# EAGLE board untitled (EAGLE 7.7.0), part 1 of 2
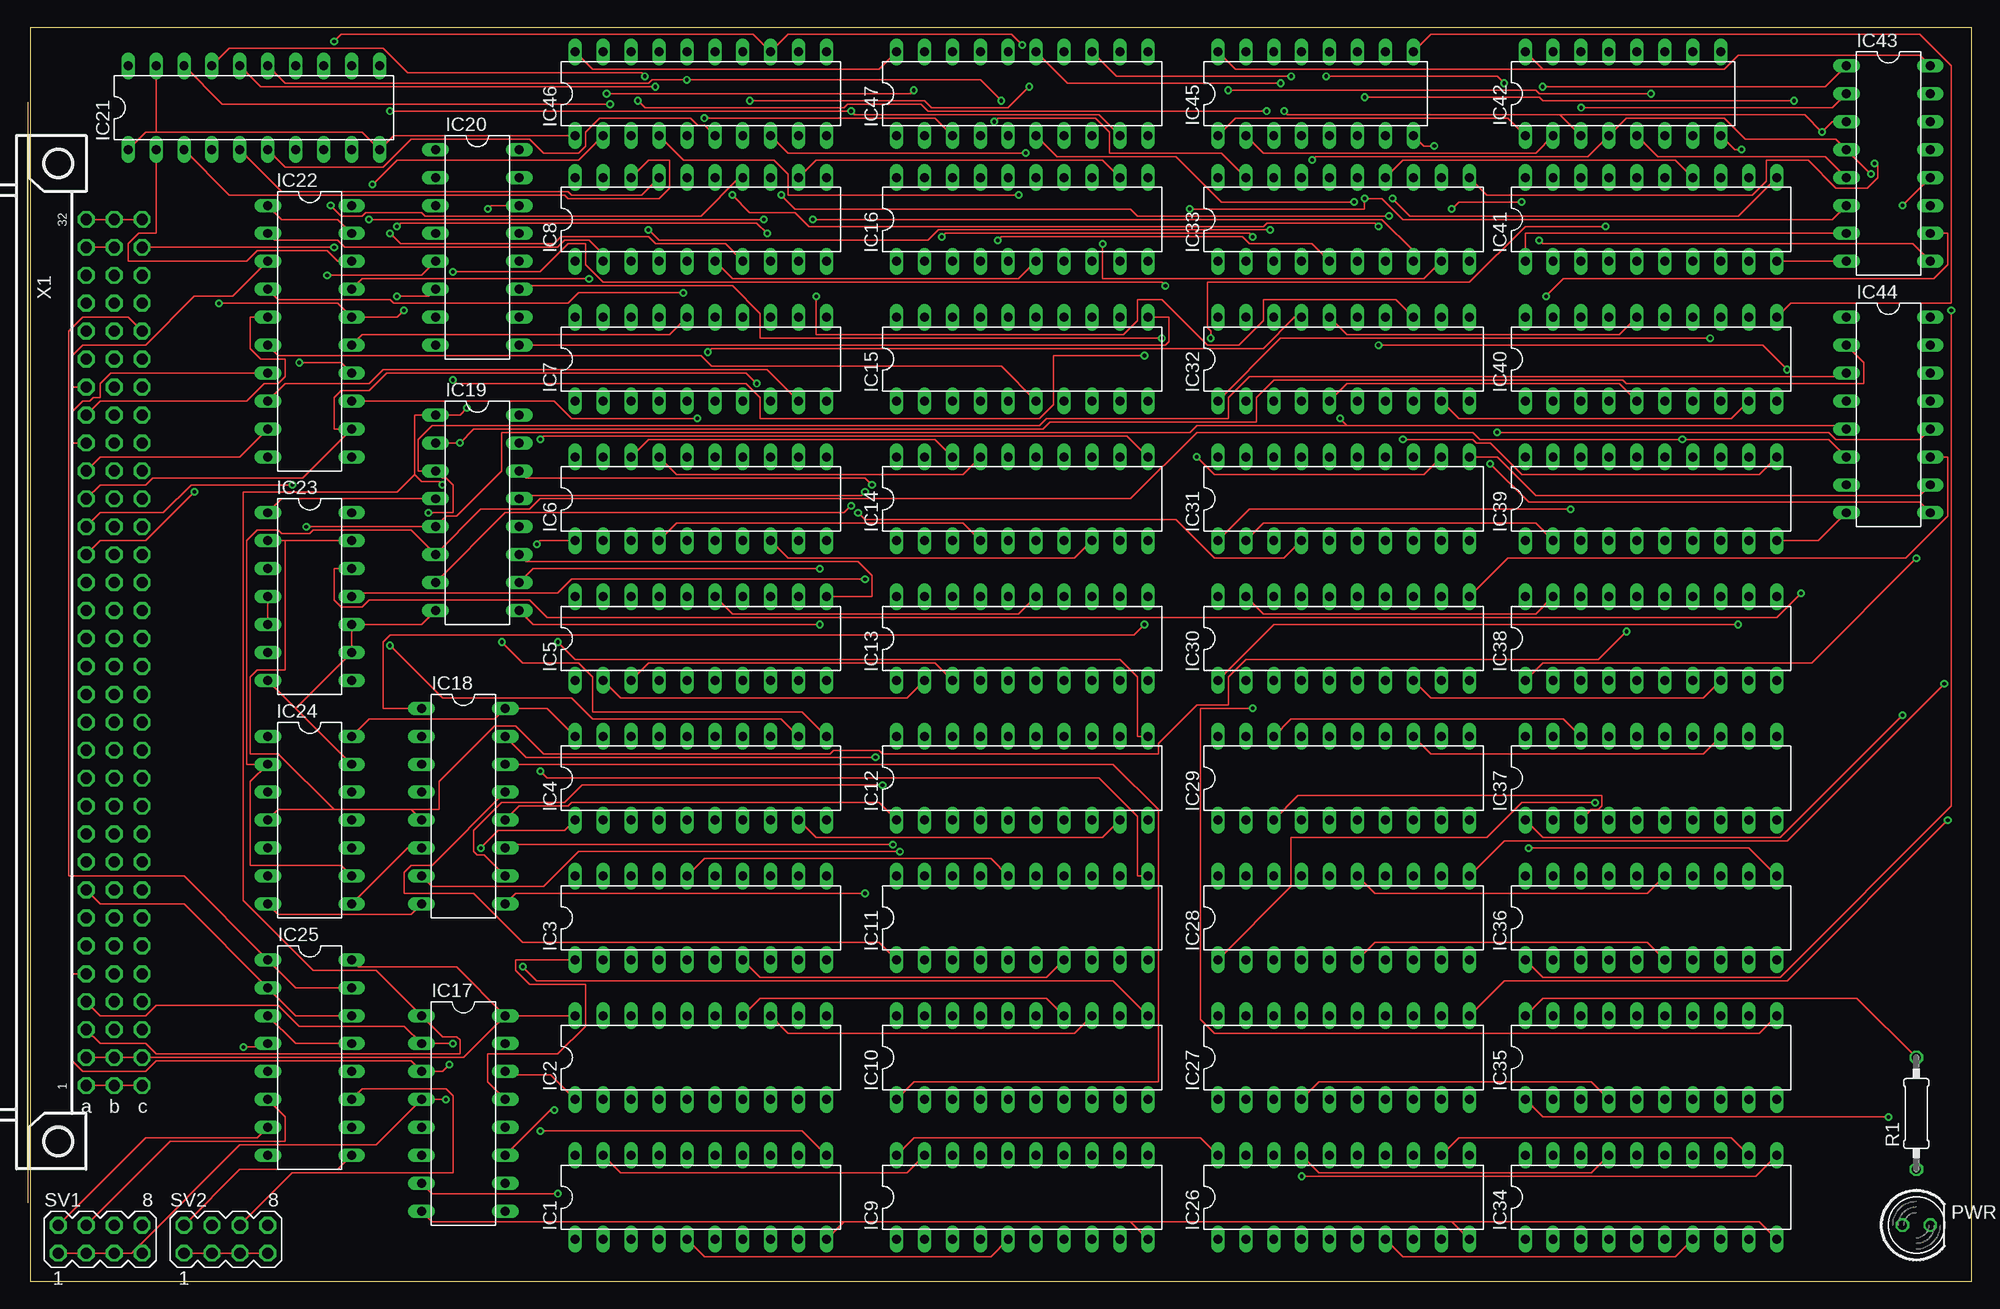
[diagram p4: board, top side]
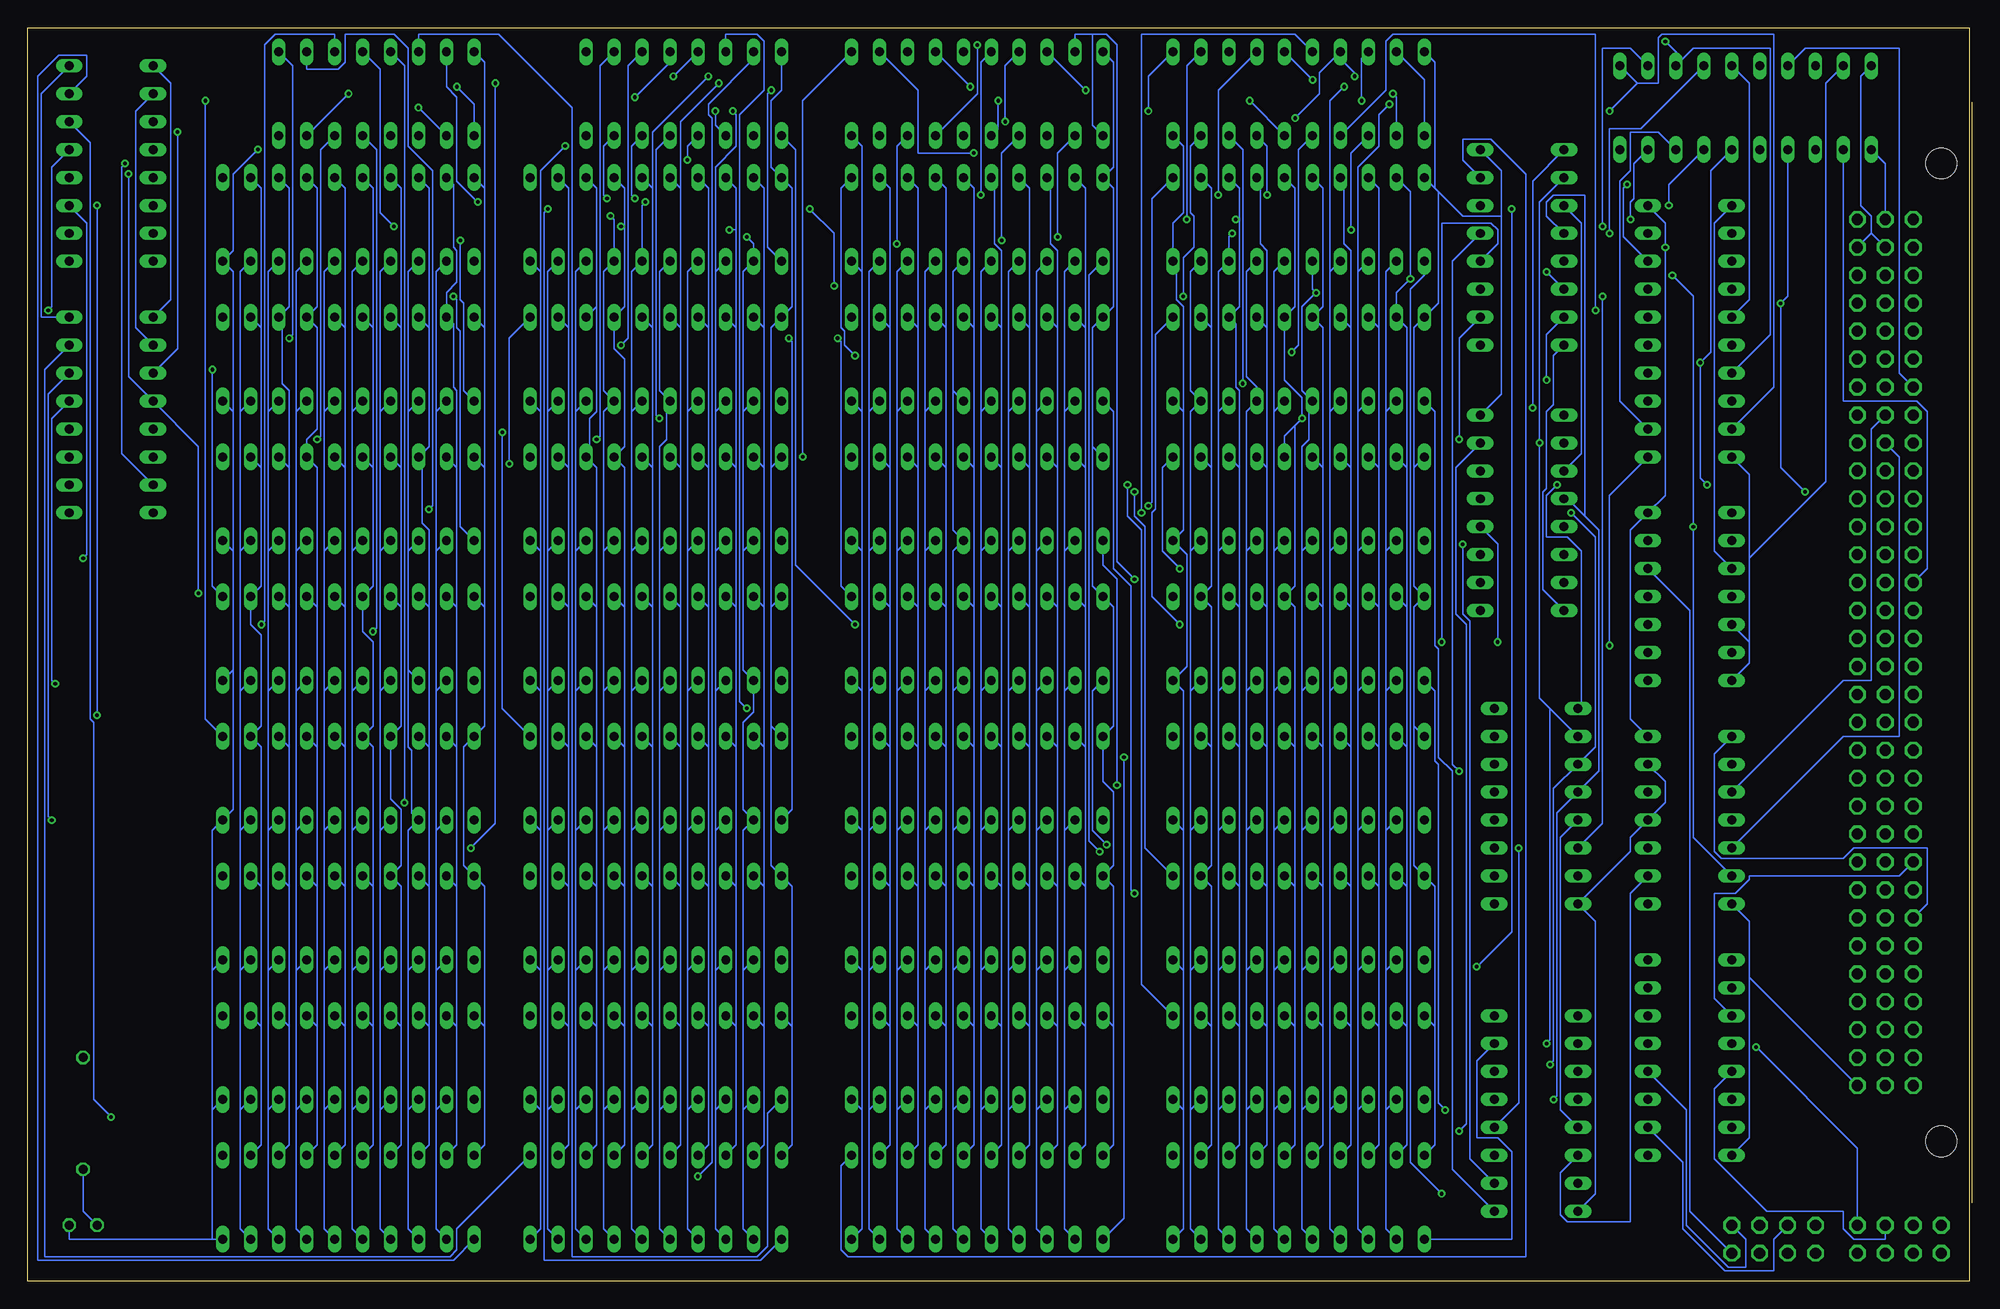
[diagram p5: board, bottom side, seen from below]

Size 176.51 x 113.97 mm. Coordinates in mm from the lower left corner, seen from the top.
Outline: 0,0 176.51,0 176.51,113.97 0,113.97 0,0
Copper layers (1*16): Top 0.0356mm / dielectric 1.5011mm / Bottom 0.0356mm
Design rules "LaenPCBOrder *": minimum track width 6mil, minimum drill 13mil, track to track 6mil, track to pad 6mil, pad to pad 6mil, via to via 6mil, smd to smd 6mil, copper to edge 15mil, drill to drill 6mil, minimum pad ring 7mil, minimum via ring 7mil, stop-mask expansion 3mil, vias tented up to drill 0mil, thermal gap 10mil

## Footprints (pad centres in the part's own frame; a part is rotated, then mirrored left to right if it is on the bottom)
DIL20 = drill 0.813 long: 1 -11.43,-3.81; 2 -8.89,-3.81; 3 -6.35,-3.81; 4 -3.81,-3.81; 5 -1.27,-3.81; 6 1.27,-3.81; 7 3.81,-3.81; 8 6.35,-3.81; 9 8.89,-3.81; 10 11.43,-3.81; 11 11.43,3.81; 12 8.89,3.81; 13 6.35,3.81; 14 3.81,3.81; 15 1.27,3.81; 16 -1.27,3.81; 17 -3.81,3.81; 18 -6.35,3.81; 19 -8.89,3.81; 20 -11.43,3.81
DIL16 = drill 0.813 long: 1 -8.89,-3.81; 2 -6.35,-3.81; 3 -3.81,-3.81; 4 -1.27,-3.81; 5 1.27,-3.81; 6 3.81,-3.81; 7 6.35,-3.81; 8 8.89,-3.81; 9 8.89,3.81; 10 6.35,3.81; 11 3.81,3.81; 12 1.27,3.81; 13 -1.27,3.81; 14 -3.81,3.81; 15 -6.35,3.81; 16 -8.89,3.81
DIL14 = drill 0.813 long: 1 -7.62,-3.81; 2 -5.08,-3.81; 3 -2.54,-3.81; 4 0,-3.81; 5 2.54,-3.81; 6 5.08,-3.81; 7 7.62,-3.81; 8 7.62,3.81; 9 5.08,3.81; 10 2.54,3.81; 11 0,3.81; 12 -2.54,3.81; 13 -5.08,3.81; 14 -7.62,3.81
LED5MM = drill 0.813 octagon: A -1.27,0; K 1.27,0
0207/10 = drill 0.813 octagon: 1 -5.08,0; 2 5.08,0
MA04-2 = drill 1.016 octagon: 1 -3.81,-1.27; 2 -3.81,1.27; 3 -1.27,-1.27; 4 -1.27,1.27; 5 1.27,-1.27; 6 1.27,1.27; 7 3.81,-1.27; 8 3.81,1.27
FABC96R = drill 1.016 octagon: A1 -2.54,39.37; A2 -2.54,36.83; A3 -2.54,34.29; A4 -2.54,31.75; A5 -2.54,29.21; A6 -2.54,26.67; A7 -2.54,24.13; A8 -2.54,21.59; A9 -2.54,19.05; A10 -2.54,16.51; A11 -2.54,13.97; A12 -2.54,11.43; A13 -2.54,8.89; A14 -2.54,6.35; A15 -2.54,3.81; A16 -2.54,1.27; A17 -2.54,-1.27; A18 -2.54,-3.81; A19 -2.54,-6.35; A20 -2.54,-8.89; A21 -2.54,-11.43; A22 -2.54,-13.97; A23 -2.54,-16.51; A24 -2.54,-19.05; A25 -2.54,-21.59; A26 -2.54,-24.13; A27 -2.54,-26.67; A28 -2.54,-29.21; A29 -2.54,-31.75; A30 -2.54,-34.29; A31 -2.54,-36.83; A32 -2.54,-39.37; B1 -5.08,39.37; B2 -5.08,36.83; B3 -5.08,34.29; B4 -5.08,31.75; B5 -5.08,29.21; B6 -5.08,26.67; B7 -5.08,24.13; B8 -5.08,21.59; B9 -5.08,19.05; B10 -5.08,16.51; B11 -5.08,13.97; B12 -5.08,11.43; B13 -5.08,8.89; B14 -5.08,6.35; B15 -5.08,3.81; B16 -5.08,1.27; B17 -5.08,-1.27; B18 -5.08,-3.81; B19 -5.08,-6.35; B20 -5.08,-8.89; B21 -5.08,-11.43; B22 -5.08,-13.97; B23 -5.08,-16.51; B24 -5.08,-19.05; B25 -5.08,-21.59; B26 -5.08,-24.13; B27 -5.08,-26.67; B28 -5.08,-29.21; B29 -5.08,-31.75; B30 -5.08,-34.29; B31 -5.08,-36.83; B32 -5.08,-39.37; C1 -7.62,39.37; C2 -7.62,36.83; C3 -7.62,34.29; C4 -7.62,31.75; C5 -7.62,29.21; C6 -7.62,26.67; C7 -7.62,24.13; C8 -7.62,21.59; C9 -7.62,19.05; C10 -7.62,16.51; C11 -7.62,13.97; C12 -7.62,11.43; C13 -7.62,8.89; C14 -7.62,6.35; C15 -7.62,3.81; C16 -7.62,1.27; C17 -7.62,-1.27; C18 -7.62,-3.81; C19 -7.62,-6.35; C20 -7.62,-8.89; C21 -7.62,-11.43; C22 -7.62,-13.97; C23 -7.62,-16.51; C24 -7.62,-19.05; C25 -7.62,-21.59; C26 -7.62,-24.13; C27 -7.62,-26.67; C28 -7.62,-29.21; C29 -7.62,-31.75; C30 -7.62,-34.29; C31 -7.62,-36.83; C32 -7.62,-39.37 | hole 2.794: 0,-44.456; 0,44.456

## Placement (x,y rotation side)
IC1  74LS374N  [DIL20]  60.96,7.62 0 top
IC2  74LS374N  [DIL20]  60.96,20.32 0 top
IC3  74LS374N  [DIL20]  60.96,33.02 0 top
IC4  74LS374N  [DIL20]  60.96,45.72 0 top
IC5  74LS374N  [DIL20]  60.96,58.42 0 top
IC6  74LS374N  [DIL20]  60.96,71.12 0 top
IC7  74LS374N  [DIL20]  60.96,83.82 0 top
IC8  74LS374N  [DIL20]  60.96,96.52 0 top
IC9  74LS374N  [DIL20]  90.17,7.62 0 top
IC10  74LS374N  [DIL20]  90.17,20.32 0 top
IC11  74LS374N  [DIL20]  90.17,33.02 0 top
IC12  74LS374N  [DIL20]  90.17,45.72 0 top
IC13  74LS374N  [DIL20]  90.17,58.42 0 top
IC14  74LS374N  [DIL20]  90.17,71.12 0 top
IC15  74LS374N  [DIL20]  90.17,83.82 0 top
IC16  74LS374N  [DIL20]  90.17,96.52 0 top
IC17  74LS138N  [DIL16]  39.37,15.24 270 top
IC18  74LS138N  [DIL16]  39.37,43.18 270 top
IC19  74LS138N  [DIL16]  40.64,69.85 270 top
IC20  74LS138N  [DIL16]  40.64,93.98 270 top
IC21  74LS244N  [DIL20]  20.32,106.68 0 top
IC22  74LS244N  [DIL20]  25.4,86.36 270 top
IC23  74LS32N  [DIL14]  25.4,62.23 270 top
IC24  74LS04N  [DIL14]  25.4,41.91 270 top
IC25  74LS139N  [DIL16]  25.4,20.32 270 top
IC26  74LS374N  [DIL20]  119.38,7.62 0 top
IC27  74LS374N  [DIL20]  119.38,20.32 0 top
IC28  74LS374N  [DIL20]  119.38,33.02 0 top
IC29  74LS374N  [DIL20]  119.38,45.72 0 top
IC30  74LS374N  [DIL20]  119.38,58.42 0 top
IC31  74LS374N  [DIL20]  119.38,71.12 0 top
IC32  74LS374N  [DIL20]  119.38,83.82 0 top
IC33  74LS374N  [DIL20]  119.38,96.52 0 top
IC34  74LS374N  [DIL20]  147.32,7.62 0 top
IC35  74LS374N  [DIL20]  147.32,20.32 0 top
IC36  74LS374N  [DIL20]  147.32,33.02 0 top
IC37  74LS374N  [DIL20]  147.32,45.72 0 top
IC38  74LS374N  [DIL20]  147.32,58.42 0 top
IC39  74LS374N  [DIL20]  147.32,71.12 0 top
IC40  74LS374N  [DIL20]  147.32,83.82 0 top
IC41  74LS374N  [DIL20]  147.32,96.52 0 top
IC42  74LS138N  [DIL16]  144.78,107.95 0 top
IC43  74LS138N  [DIL16]  168.91,101.6 270 top
IC44  74LS138N  [DIL16]  168.91,78.74 270 top
IC45  74LS138N  [DIL16]  116.84,107.95 0 top
IC46  74LS244N  [DIL20]  60.96,107.95 0 top
IC47  74LS244N  [DIL20]  90.17,107.95 0 top
PWR  l1  [LED5MM]  171.45,5.08 0 top
R1  330  [0207/10]  171.45,15.24 90 top
SV1  [MA04-2]  6.35,3.81 0 top
SV2  [MA04-2]  17.78,3.81 0 top
X1  FABC96R  [FABC96R]  2.54,57.15 180 top

## Tracks (layer width: path | path; a pad name or v marks a point on that pad's centre or on a via)
-BADDR4  (via drill 0.33)
  Top 0.152: IC44.6 163.51,76.52 v150.18,76.52 131.76,76.52 131.13,77.15 106.05,77.15 100.01,71.12 46.35,71.12 45.4,70.17 40.96,70.17 IC19.6 34.61,68.26 25.72,68.26 25.4,67.94 22.86,67.94 22.54,68.26 20.64,68.26 19.68,67.31 19.68,46.99 IC24.2 20,45.4 20,37.78 28.26,37.78 IC24.9
  Bottom 0.152: v150.18,76.52 149.86,76.83 149.86,102.87 IC42.6 | IC17.6 37.15,9.84 37.15,6.03 36.51,5.4 30.8,5.4 30.8,35.24 IC24.9
-BANK0-SEL  (via drill 0.33)
  Top 0.152: SV1.1 SV1.3 SV1.5 9.21,2.54 9.53,2.86 | 9.53,2.86 19.05,12.38 31.43,12.38 IC17.4 v37.78,16.51 | SV1.7 9.84,2.86 9.53,2.86 | IC23.1 22.86,71.12 IC19.4
  Bottom 0.152: 34.92,69.53 36.51,71.12 IC19.4 | 34.92,69.53 33.66,68.26 33.66,46.35 IC18.4 37.47,42.55 37.47,16.83 v37.78,16.51 | IC20.4 38.42,96.84 38.42,98.11 37.78,98.74 34.92,98.74 34.92,69.53
-BANK1-SEL  (via drill 0.33)
  Top 0.152: v167.32,100.65 IC43.4 164.15,103.82 155.89,103.82 153.99,105.73 145.1,105.73 IC42.4 141.6,102.23 116.84,102.23 v116.52,101.92 | SV2.1 SV2.3 SV2.5 SV2.7 | v160.97,62.55 158.75,60.33 46.99,60.33 45.4,61.91 30.8,61.91 30.16,61.28 28.26,61.28 27.62,61.91 27.62,64.77 IC23.12
  Bottom 0.152: v167.32,100.65 167.32,82.23 IC44.4 160.97,75.88 v160.97,62.55 | IC45.4 116.52,103.19 v116.52,101.92 | IC23.12 25.4,60.96 25.4,6.35 SV2.7
-BUS-ACTIVE
  Top 0.152: IC25.15 24.13,26.67 IC25.1 13.97,36.83 3.49,36.83 3.49,86.36 4.76,87.63 8.89,87.63 X1.C28
-MEMRD  (via drill 0.33)
  Top 0.152: IC43.5 163.19,102.23 147.96,102.23 IC42.5 | IC23.13 23.18,67.31 | 23.18,67.31 IC23.2 | IC24.4 22.54,42.86 27.62,42.86 | 34.61,42.86 27.62,42.86 | IC18.5 34.61,42.86 | 23.18,67.31 23.18,55.56 20.64,55.56 20,54.93 20,47.94 22.54,47.94 27.62,42.86 | v145.1,59.05 142.56,56.52 110.49,56.52 108.9,54.93 108.9,52.39 106.05,52.39 102.55,48.9 102.55,47.94 77.47,47.94 77.15,48.26 73.03,48.26 72.71,47.94 46.67,47.94 44.13,50.48 42.23,50.48 37.15,45.4 37.15,42.86 34.61,42.86
  Bottom 0.152: IC17.5 37.15,15.56 37.15,40.32 IC18.5 | IC42.5 144.78,102.87 144.78,59.37 v145.1,59.05
-MEMWR  (via drill 0.33)
  Top 0.152: v25.08,68.58 IC19.5 37.78,69.53 38.73,69.53 42.86,73.66 42.86,77.15 105.41,77.15 106.05,77.79 119.7,77.79 | IC20.5 35.56,91.44 v26.99,91.44 | 119.7,77.79 v119.06,78.42 | 119.7,77.79 164.78,77.79 IC44.5
  Bottom 0.152: IC24.6 25.08,40.32 v25.08,68.58 25.08,89.53 v26.99,91.44 | IC45.5 119.38,102.87 119.38,78.74 v119.06,78.42
ADDR0  (via drill 0.33)
  Top 0.152: IC45.1 109.54,105.73 134.3,105.73 IC42.1 | IC43.1 163.19,108.58 v137.48,108.58 | X1.A3 6.35,21.59 10.48,21.59 11.43,20.64 39.05,20.64 39.05,21.91 38.73,22.23 37.47,22.23 IC17.1 31.43,28.26 25.72,28.26 19.37,34.61 19.37,71.75 33.34,71.75 34.92,73.34 | v37.47,72.39 37.15,72.71 35.56,72.71 34.92,73.34 | 34.92,73.34 34.92,78.74 IC19.1 39.05,78.74 v39.69,79.38 | v101.28,59.69 100.33,58.74 32.7,58.74 32.07,58.1 32.07,52.07 IC18.1
  Bottom 0.152: IC44.1 163.51,89.22 163.51,108.9 IC43.1 | v137.48,108.58 135.89,107 IC42.1 | IC18.1 35.24,52.39 35.24,66.36 36.51,67.63 38.42,67.63 38.42,71.44 v37.47,72.39 | IC20.1 39.69,100.01 v39.69,79.38 | IC45.1 106.68,102.87 106.68,65.09 v101.28,59.69
ADDR1  (via drill 0.33)
  Top 0.152: IC45.2 112.08,102.55 136.84,102.55 IC42.2 | IC43.2 163.83,106.68 v140.97,106.68 | X1.A4 6.35,24.13 10.48,24.13 11.43,25.08 22.54,25.08 24.45,23.18 33.97,23.18 IC17.2 v38.42,21.59 | IC19.2 v39.05,76.2 40.32,77.47 92.08,77.47 92.71,78.11 111.44,78.11 111.44,80.33 113.03,81.92 144.78,81.92 145.1,81.6 166.69,81.6 166.69,83.5 IC44.2
  Bottom 0.152: IC44.2 166.69,86.68 166.69,106.36 IC43.2 | IC42.2 v140.97,106.68 | 38.1,52.07 39.05,53.02 v39.05,76.2 39.05,98.11 IC20.2 | 38.1,52.07 IC18.2 | v38.42,21.59 38.1,21.91 38.1,52.07
ADDR2  (via drill 0.33)
  Top 0.152: IC43.3 163.83,105.41 v162.88,104.46 161.29,106.05 139.06,106.05 | v113.98,106.36 114.3,106.05 139.06,106.05 | IC42.3 139.06,106.05 | X1.A5 3.81,27.94 3.81,20 4.76,19.05 10.48,19.05 11.43,20 34.61,20 IC17.3 37.47,19.05 v38.1,19.68 | v36.2,69.85 38.42,69.85 38.42,72.39 37.78,73.03 37.47,73.03 IC19.3 35.24,73.66 35.24,76.52 36.51,77.79 91.76,77.79 92.39,78.42 108.9,78.42 108.9,80.33 110.81,82.23 164.78,82.23 IC44.3
  Bottom 0.152: IC44.3 162.88,84.77 v162.88,104.46 | IC45.3 113.98,105.09 v113.98,106.36 | IC19.3 35.24,75.25 35.24,96.2 IC20.3 | v38.1,19.68 37.78,20 37.78,44.77 IC18.3 33.97,48.58 33.97,67.63 v36.2,69.85
ADDR4
  Bottom 0.152: IC24.1 23.18,47.94 23.18,39.05 22.54,38.42 11.43,38.42 10.48,39.37 3.81,39.37 3.81,34.29 X1.A7
ADDR5
  Top 0.152: IC25.14 24.13,24.13 IC25.2 13.97,34.29 6.35,34.29 X1.A8
ADDR6
  Top 0.152: IC25.3 24.13,21.59 IC25.13
  Bottom 0.152: X1.A9 6.35,36.83 20,36.83 20,36.51 21.27,35.24 23.18,35.24 23.18,25.72 IC25.3
BADDR4  (via drill 0.33)
  Top 0.152: IC43.6 163.83,96.52 124.78,96.52 122.87,98.42 v121.28,98.42 121.28,97.47 v105.41,97.47 | IC24.8 34.29,39.37 IC18.6 | IC20.6 36.2,89.53 v33.34,89.53 | v103.19,90.49 102.87,90.81 52.07,90.81 50.48,92.39 50.48,94.3 48.9,94.3 46.35,91.76 v38.42,91.76
  Bottom 0.152: v121.28,98.42 121.6,98.74 121.6,103.19 IC45.6 | v33.34,89.53 33.34,41.59 IC18.6 | v105.41,97.47 103.19,95.25 v103.19,90.49 | IC20.6 v38.42,91.76
DATA0  (via drill 0.33)
  Top 0.152: IC21.2 11.43,95.25 9.84,95.25 8.89,94.3 8.89,92.71 19.68,92.71 20.64,93.66 26.99,93.66 27.94,92.71 IC22.18 | IC46.2 49.85,101.92 33.34,101.92 v31.11,99.69 | v80.33,108.27 80.01,107.95 v52.39,107.95
  Bottom 0.152: v31.11,99.69 31.43,99.38 31.43,94.93 IC22.18 | v80.33,108.27 IC47.18 | v52.39,107.95 52.07,107.63 IC46.2 | X1.A19 3.81,64.77 3.81,79.06 4.76,80.01 11.43,80.01 IC21.2
DATA1  (via drill 0.33)
  Top 0.152: IC46.4 59.37,101.92 67.63,101.92 68.9,100.65 68.9,98.74 v89.85,98.74 | v17.14,88.9 27.94,88.9 IC22.16 33.34,87.63 v33.97,88.27 | X1.A20 6.35,67.31 10.48,67.31 v14.92,71.75
  Bottom 0.152: v89.85,98.74 89.85,110.81 IC47.16 | IC21.4 16.51,89.53 v17.14,88.9 17.14,73.98 v14.92,71.75 | IC46.4 53.02,108.27 53.02,112.71 52.39,113.35 33.97,113.35 v33.97,88.27
DATA2  (via drill 0.33)
  Top 0.152: IC22.14 28.26,83.5 v24.45,83.5 | IC46.6 61.28,105.09 60.64,105.09 60.01,105.73 51.75,105.73 50.48,104.46 50.48,103.19 49.85,102.55 46.67,102.55 45.4,103.82 34.61,103.82 32.07,101.28 23.18,101.28 IC21.6 | v90.81,108.58 88.9,106.68 81.92,106.68 81.28,107.31 v65.41,107.31 | X1.A21 6.35,69.85 12.06,69.85 14.61,72.39 v23.81,72.39
  Bottom 0.152: IC21.6 23.5,100.97 23.5,84.45 v24.45,83.5 24.45,73.03 v23.81,72.39 | v90.81,108.58 IC47.14 | IC46.6 v65.41,107.31
DATA3  (via drill 0.33)
  Top 0.152: IC46.8 68.9,102.55 v90.49,102.55 | X1.A22 6.35,72.39 10.48,72.39 11.11,73.03 24.77,73.03 IC22.12 27.62,77.47 27.62,80.33 28.26,80.96 30.8,80.96 32.38,82.55 65.09,82.55 v66.04,81.6
  Bottom 0.152: v90.49,102.55 95.57,102.55 95.57,108.27 IC47.12 | IC21.8 28.26,104.46 30.8,104.46 30.8,100.97 31.75,100.01 31.75,80.01 IC22.12 | IC46.8 66.04,102.87 v66.04,81.6
DATA4  (via drill 0.33)
  Top 0.152: IC47.9 97.16,106.05 74.93,106.05 v74.61,106.36 v32.7,106.36 | IC22.9 19.05,74.93 6.35,74.93 X1.A23
  Bottom 0.152: IC46.11 74.61,109.54 v74.61,106.36 | 30.16,108.9 IC21.11 | 30.16,108.9 28.26,108.9 28.26,113.03 27.94,113.35 17.78,113.35 17.78,81.28 IC22.9 | 30.16,108.9 v32.7,106.36
DATA5  (via drill 0.33)
  Top 0.152: v90.17,112.39 89.22,113.35 68.9,113.35 IC46.13 65.72,113.35 28.26,113.35 v27.62,112.71 | IC22.7 7.3,82.55 6.35,81.6 6.35,80.33 5.71,80.33 5.4,80.01 4.76,80.01 3.81,79.06 3.81,76.2 X1.A24
  Bottom 0.152: IC47.7 90.17,107.95 v90.17,112.39 | 26.04,111.12 25.08,112.08 18.1,112.08 18.1,86.04 IC22.7 | 26.04,111.12 IC21.13 | 26.04,111.12 v27.62,112.71
DATA6  (via drill 0.33)
  Top 0.152: IC21.15 23.18,108.9 56.2,108.9 56.52,109.22 v59.69,109.22 86.36,109.22 v88.27,107.31 | X1.A25 6.35,80.01 19.68,80.01 21.27,81.6 22.54,81.6 23.18,82.23 23.18,83.82 20.95,83.82 20,84.77 20,87.63 IC22.5
  Bottom 0.152: IC22.5 20,89.22 20,108.9 IC21.15 | v59.69,109.22 IC46.15 | IC47.5 88.27,104.78 v88.27,107.31
DATA7  (via drill 0.33)
  Top 0.152: v61.28,105.73 82.23,105.73 IC47.3 | IC22.3 18.41,89.53 14.92,89.53 10.48,85.09 4.76,85.09 3.81,84.14 3.81,81.28 X1.A26 | v55.88,109.54 55.56,109.86 34.29,109.86 32.07,112.08 18.1,112.08 IC21.17
  Bottom 0.152: 57.47,111.44 59.05,109.86 59.05,107.95 v61.28,105.73 | IC21.17 14.92,112.08 6.35,112.08 6.35,82.55 X1.A26 | 57.47,111.44 55.88,109.86 v55.88,109.54 | 57.47,111.44 IC46.17
DATA-IN0  (via drill 0.33)
  Top 0.152: IC21.18 17.46,107 v52.7,107 | IC13.3 82.23,56.2 56.2,56.2 IC5.3
  Bottom 0.152: IC9.3 84.77,4.76 84.77,15.56 | IC10.3 84.77,15.56 | 84.77,28.26 IC11.3 | 84.77,15.56 84.77,28.26 | 84.77,40.96 IC12.3 | 84.77,28.26 84.77,40.96 | 84.77,53.66 IC13.3 | 84.77,40.96 84.77,53.66 | 84.77,66.36 IC14.3 | 84.77,53.66 84.77,66.36 | 84.77,79.06 IC15.3 | 84.77,66.36 84.77,79.06 | IC16.3 84.77,91.76 84.77,79.06 | IC1.3 55.56,4.76 55.56,15.56 | IC2.3 55.56,15.56 | 55.56,28.26 IC3.3 | 55.56,15.56 55.56,28.26 | 55.56,40.96 IC4.3 | 55.56,28.26 55.56,40.96 | 55.56,53.66 IC5.3 | 55.56,40.96 55.56,53.66 | 55.56,66.36 IC6.3 | 55.56,53.66 55.56,66.36 | 55.56,79.06 IC7.3 | 55.56,66.36 55.56,79.06 | 55.56,91.76 IC8.3 | 55.56,79.06 55.56,91.76 | v52.7,107 53.66,106.05 53.66,103.19 55.56,101.28 55.56,91.76
DATA-IN1  (via drill 0.33)
  Top 0.152: IC21.16 20.95,108.58 v56.83,108.58 | IC14.4 84.77,68.9 58.74,68.9 IC6.4
  Bottom 0.152: IC9.4 87.31,4.76 87.31,15.56 | IC10.4 87.31,15.56 | 87.31,28.26 IC11.4 | 87.31,15.56 87.31,28.26 | 87.31,40.96 IC12.4 | 87.31,28.26 87.31,40.96 | 87.31,53.66 IC13.4 | 87.31,40.96 87.31,53.66 | 87.31,66.36 IC14.4 | 87.31,53.66 87.31,66.36 | 87.31,79.06 IC15.4 | 87.31,66.36 87.31,79.06 | IC16.4 87.31,91.76 87.31,79.06 | IC1.4 58.1,4.76 58.1,15.56 | IC2.4 58.1,15.56 | 58.1,28.26 IC3.4 | 58.1,15.56 58.1,28.26 | 58.1,40.96 IC4.4 | 58.1,28.26 58.1,40.96 | 58.1,53.66 IC5.4 | 58.1,40.96 58.1,53.66 | 58.1,66.36 IC6.4 | 58.1,53.66 58.1,66.36 | 58.1,79.06 IC7.4 | 58.1,66.36 58.1,79.06 | 58.1,91.76 IC8.4 | 58.1,79.06 58.1,91.76 | v56.83,108.58 58.1,107.31 58.1,91.76
DATA-IN2  (via drill 0.33)
  Top 0.152: v32.7,95.25 33.66,94.3 47.62,94.3 48.26,94.93 56.2,94.93 56.83,94.3 63.18,94.3 IC8.7 | IC11.7 92.39,27.62 66.36,27.62 IC3.7
  Bottom 0.152: IC9.7 94.93,4.76 94.93,15.56 | IC10.7 94.93,15.56 | 94.93,28.26 IC11.7 | 94.93,15.56 94.93,28.26 | 94.93,40.96 IC12.7 | 94.93,28.26 94.93,40.96 | 94.93,53.66 IC13.7 | 94.93,40.96 94.93,53.66 | 94.93,66.36 IC14.7 | 94.93,53.66 94.93,66.36 | 94.93,79.06 IC15.7 | 94.93,66.36 94.93,79.06 | IC16.7 94.93,91.76 94.93,79.06 | IC1.7 65.72,4.76 65.72,15.56 | IC2.7 65.72,15.56 | 65.72,28.26 IC3.7 | 65.72,15.56 65.72,28.26 | 65.72,40.96 IC4.7 | 65.72,28.26 65.72,40.96 | 65.72,53.66 IC5.7 | 65.72,40.96 65.72,53.66 | 65.72,66.36 IC6.7 | 65.72,53.66 65.72,66.36 | 65.72,66.36 65.72,79.06 IC7.7 64.77,81.28 65.72,82.23 65.72,91.76 IC8.7 | IC21.14 29.84,104.78 32.7,104.78 v32.7,95.25
DATA-IN3  (via drill 0.33)
  Top 0.152: v33.34,95.89 33.66,96.2 66.04,96.2 v66.99,95.25 | IC14.8 94.93,65.72 68.9,65.72 IC6.8
  Bottom 0.152: IC9.8 97.47,4.76 97.47,15.56 | IC10.8 97.47,15.56 | 97.47,28.26 IC11.8 | 97.47,15.56 97.47,28.26 | 97.47,40.96 IC12.8 | 97.47,28.26 97.47,40.96 | 97.47,53.66 IC13.8 | 97.47,40.96 97.47,53.66 | 97.47,66.36 IC14.8 | 97.47,53.66 97.47,66.36 | 97.47,79.06 IC15.8 | 97.47,66.36 97.47,79.06 | IC16.8 97.47,91.76 97.47,79.06 | IC1.8 68.26,4.76 68.26,15.56 | IC2.8 68.26,15.56 | 68.26,28.26 IC3.8 | 68.26,15.56 68.26,28.26 | 68.26,40.96 IC4.8 | 68.26,28.26 68.26,40.96 | 68.26,53.66 IC5.8 | 68.26,40.96 68.26,53.66 | 68.26,66.36 IC6.8 | 68.26,53.66 68.26,66.36 | 68.26,79.06 IC7.8 | 68.26,66.36 68.26,79.06 | 68.26,79.06 68.26,91.76 IC8.8 67.31,94.93 v66.99,95.25 | IC21.12 30.8,112.08 33.34,112.08 v33.34,95.89
DATA-IN4  (via drill 0.33)
  Top 0.152: v66.67,96.52 v30.8,96.52 | IC10.13 94.93,22.54 68.9,22.54 IC2.13
  Bottom 0.152: IC9.13 95.57,12.38 95.57,23.18 | IC10.13 95.57,23.18 | 95.57,35.88 IC11.13 | 95.57,23.18 95.57,35.88 | 95.57,48.58 IC12.13 | 95.57,35.88 95.57,48.58 | 95.57,61.28 IC13.13 | 95.57,48.58 95.57,61.28 | 95.57,73.98 IC14.13 | 95.57,61.28 95.57,73.98 | 95.57,86.68 IC15.13 | 95.57,73.98 95.57,86.68 | IC16.13 95.57,99.38 95.57,86.68 | 66.36,96.52 66.36,99.38 IC8.13 | 66.36,96.52 66.36,88.58 IC7.13 66.67,87 66.67,81.28 66.36,80.96 66.36,73.98 | IC21.9 30.48,101.6 30.48,98.42 30.8,98.11 v30.8,96.52 | 66.36,96.52 v66.67,96.52 | IC1.13 66.36,12.38 66.36,23.18 | IC2.13 66.36,23.18 | 66.36,35.88 IC3.13 | 66.36,23.18 66.36,35.88 | 66.36,48.58 IC4.13 | 66.36,35.88 66.36,48.58 | 66.36,61.28 IC5.13 | 66.36,48.58 66.36,61.28 | 66.36,73.98 IC6.13 | 66.36,61.28 66.36,73.98
DATA-IN5  (via drill 0.33)
  Top 0.152: v27.3,97.79 28.26,96.84 30.16,96.84 30.48,97.16 35.56,97.16 35.88,96.84 60.96,96.84 64.45,100.33 IC8.14 | IC10.14 92.39,25.72 66.36,25.72 IC2.14
  Bottom 0.152: IC9.14 93.03,12.38 93.03,23.18 | IC10.14 93.03,23.18 | 93.03,35.88 IC11.14 | 93.03,23.18 93.03,35.88 | 93.03,48.58 IC12.14 | 93.03,35.88 93.03,48.58 | 93.03,61.28 IC13.14 | 93.03,48.58 93.03,61.28 | 93.03,73.98 IC14.14 | 93.03,61.28 93.03,73.98 | 93.03,86.68 IC15.14 | 93.03,73.98 93.03,86.68 | IC16.14 93.03,99.38 93.03,86.68 | IC1.14 63.82,12.38 63.82,23.18 | IC2.14 63.82,23.18 | 63.82,35.88 IC3.14 | 63.82,23.18 63.82,35.88 | 63.82,48.58 IC4.14 | 63.82,35.88 63.82,48.58 | 63.82,61.28 IC5.14 | 63.82,48.58 63.82,61.28 | 63.82,73.98 IC6.14 | 63.82,61.28 63.82,73.98 | 63.82,86.68 IC7.14 | 63.82,73.98 63.82,86.68 | IC8.14 64.45,100.01 64.45,94.3 63.82,93.66 63.82,86.68 | IC21.7 27.3,99.69 v27.3,97.79
DATA-IN6
  Top 0.152: IC21.5 22.86,99.06 48.9,99.06 49.21,98.74 55.56,98.74 IC8.17 | IC14.17 84.77,73.34 58.74,73.34 IC6.17
  Bottom 0.152: IC9.17 85.41,12.38 85.41,23.18 | IC10.17 85.41,23.18 | 85.41,35.88 IC11.17 | 85.41,23.18 85.41,35.88 | 85.41,48.58 IC12.17 | 85.41,35.88 85.41,48.58 | 85.41,61.28 IC13.17 | 85.41,48.58 85.41,61.28 | 85.41,73.98 IC14.17 | 85.41,61.28 85.41,73.98 | 85.41,86.68 IC15.17 | 85.41,73.98 85.41,86.68 | IC16.17 85.41,99.38 85.41,86.68 | IC1.17 56.2,12.38 56.2,23.18 | IC2.17 56.2,23.18 | 56.2,35.88 IC3.17 | 56.2,23.18 56.2,35.88 | 56.2,48.58 IC4.17 | 56.2,35.88 56.2,48.58 | 56.2,61.28 IC5.17 | 56.2,48.58 56.2,61.28 | 56.2,73.98 IC6.17 | 56.2,61.28 56.2,73.98 | 56.2,86.68 IC7.17 | 56.2,73.98 56.2,86.68 | IC8.17 56.83,100.01 56.83,94.3 56.2,93.66 56.2,86.68
DATA-IN7
  Top 0.152: IC21.3 18.1,98.74 48.58,98.74 48.9,98.42 57.15,98.42 58.1,99.38 58.1,101.92 56.2,101.92 IC8.18 | IC14.18 82.23,76.52 56.2,76.52 IC6.18
  Bottom 0.152: IC9.18 82.87,12.38 82.87,23.18 | IC10.18 82.87,23.18 | 82.87,35.88 IC11.18 | 82.87,23.18 82.87,35.88 | 82.87,48.58 IC12.18 | 82.87,35.88 82.87,48.58 | 82.87,61.28 IC13.18 | 82.87,48.58 82.87,61.28 | 82.87,73.98 IC14.18 | 82.87,61.28 82.87,73.98 | 82.87,86.68 IC15.18 | 82.87,73.98 82.87,86.68 | IC16.18 83.5,100.01 83.5,94.3 82.87,93.66 82.87,86.68 | IC1.18 53.66,12.38 53.66,23.18 | IC2.18 53.66,23.18 | 53.66,35.88 IC3.18 | 53.66,23.18 53.66,35.88 | 53.66,48.58 IC4.18 | 53.66,35.88 53.66,48.58 | 53.66,61.28 IC5.18 | 53.66,48.58 53.66,61.28 | 53.66,73.98 IC6.18 | 53.66,61.28 53.66,73.98 | 53.66,86.68 IC7.18 | 53.66,73.98 53.66,86.68 | IC8.18 53.66,99.38 53.66,86.68
DATA-OUT0
  Top 0.152: IC22.2 22.23,94.61 27.94,94.61 28.57,93.98 47.94,93.98 48.58,94.61 50.8,94.61 52.07,93.34 IC8.2 | IC13.2 79.69,53.02 53.66,53.02 IC5.2
  Bottom 0.152: IC9.2 82.23,4.76 82.23,15.56 | IC10.2 82.23,15.56 | 82.23,28.26 IC11.2 | 82.23,15.56 82.23,28.26 | 82.23,40.96 IC12.2 | 82.23,28.26 82.23,40.96 | 82.23,53.66 IC13.2 | 82.23,40.96 82.23,53.66 | 82.23,66.36 IC14.2 | 82.23,53.66 82.23,66.36 | 82.23,79.06 IC15.2 | 82.23,66.36 82.23,79.06 | IC16.2 82.23,91.76 82.23,79.06 | IC1.2 53.02,4.76 53.02,15.56 | IC2.2 53.02,15.56 | 53.02,28.26 IC3.2 | 53.02,15.56 53.02,28.26 | 53.02,40.96 IC4.2 | 53.02,28.26 53.02,40.96 | 53.02,53.66 IC5.2 | 53.02,40.96 53.02,53.66 | 53.02,66.36 IC6.2 | 53.02,53.66 53.02,66.36 | 53.02,79.06 IC7.2 | 53.02,66.36 53.02,79.06 | IC8.2 53.02,91.76 53.02,79.06
DATA-OUT1  (via drill 0.33)
  Top 0.152: IC22.4 22.54,89.22 32.7,89.22 33.02,88.9 48.9,88.9 49.85,89.85 v59.37,89.85 | IC9.5 87.31,2.22 61.28,2.22 IC1.5
  Bottom 0.152: IC9.5 89.85,4.76 89.85,15.56 | IC10.5 89.85,15.56 | 89.85,28.26 IC11.5 | 89.85,15.56 89.85,28.26 | 89.85,40.96 IC12.5 | 89.85,28.26 89.85,40.96 | 89.85,53.66 IC13.5 | 89.85,40.96 89.85,53.66 | 89.85,66.36 IC14.5 | 89.85,53.66 89.85,66.36 | 89.85,79.06 IC15.5 | 89.85,66.36 89.85,79.06 | IC16.5 89.85,91.76 89.85,79.06 | IC8.5 59.69,90.17 v59.37,89.85 60.64,88.58 60.64,80.96 IC7.5 60.01,79.69 60.01,76.52 60.64,75.88 60.64,66.36 | IC1.5 60.64,4.76 60.64,15.56 | IC2.5 60.64,15.56 | 60.64,28.26 IC3.5 | 60.64,15.56 60.64,28.26 | 60.64,40.96 IC4.5 | 60.64,28.26 60.64,40.96 | 60.64,53.66 IC5.5 | 60.64,40.96 60.64,53.66 | 60.64,66.36 IC6.5 | 60.64,53.66 60.64,66.36
DATA-OUT2
  Top 0.152: IC22.6 22.54,84.14 60.96,84.14 61.91,83.19 88.27,83.19 IC15.6 | IC8.6 63.82,91.12 89.85,91.12 IC16.6
  Bottom 0.152: IC1.6 63.18,4.76 63.18,15.56 | IC2.6 63.18,15.56 | 63.18,28.26 IC3.6 | 63.18,15.56 63.18,28.26 | 63.18,40.96 IC4.6 | 63.18,28.26 63.18,40.96 | 63.18,53.66 IC5.6 | 63.18,40.96 63.18,53.66 | 63.18,66.36 IC6.6 | 63.18,53.66 63.18,66.36 | 63.18,79.06 IC7.6 | 63.18,66.36 63.18,79.06 | IC8.6 63.18,91.76 63.18,79.06 | IC9.6 92.39,4.76 92.39,15.56 | IC10.6 92.39,15.56 | 92.39,28.26 IC11.6 | 92.39,15.56 92.39,28.26 | 92.39,40.96 IC12.6 | 92.39,28.26 92.39,40.96 | 92.39,53.66 IC13.6 | 92.39,40.96 92.39,53.66 | 92.39,53.66 92.39,66.36 IC14.6 92.39,68.26 92.39,80.96 | IC16.6 92.39,91.76 92.39,80.96 | IC15.6 92.39,80.96
DATA-OUT3
  Top 0.152: IC22.8 23.18,81.6 30.8,81.6 32.07,82.87 66.99,82.87 IC7.9 | IC12.9 97.47,40.32 71.44,40.32 IC4.9
  Bottom 0.152: IC9.9 100.01,4.76 100.01,15.56 | IC10.9 100.01,15.56 | 100.01,28.26 IC11.9 | 100.01,15.56 100.01,28.26 | 100.01,40.96 IC12.9 | 100.01,28.26 100.01,40.96 | 100.01,53.66 IC13.9 | 100.01,40.96 100.01,53.66 | 100.01,66.36 IC14.9 | 100.01,53.66 100.01,66.36 | 100.01,79.06 IC15.9 | 100.01,66.36 100.01,79.06 | IC16.9 100.01,91.76 100.01,79.06 | IC8.9 70.8,91.76 70.8,80.96 IC7.9 70.8,79.06 70.8,66.36 | IC1.9 70.8,4.76 70.8,15.56 | IC2.9 70.8,15.56 | 70.8,28.26 IC3.9 | 70.8,15.56 70.8,28.26 | 70.8,40.96 IC4.9 | 70.8,28.26 70.8,40.96 | 70.8,53.66 IC5.9 | 70.8,40.96 70.8,53.66 | 70.8,66.36 IC6.9 | 70.8,53.66 70.8,66.36
DATA-OUT4  (via drill 0.33)
  Top 0.152: v32.7,57.78 37.47,53.02 49.21,53.02 51.12,51.12 68.26,51.12 IC4.12 | IC16.12 97.47,101.92 71.44,101.92 IC8.12
  Bottom 0.152: IC9.12 98.11,12.38 98.11,23.18 | IC10.12 98.11,23.18 | 98.11,35.88 IC11.12 | 98.11,23.18 98.11,35.88 | 98.11,48.58 IC12.12 | 98.11,35.88 98.11,48.58 | 98.11,61.28 IC13.12 | 98.11,48.58 98.11,61.28 | 98.11,73.98 IC14.12 | 98.11,61.28 98.11,73.98 | 98.11,86.68 IC15.12 | 98.11,73.98 98.11,86.68 | IC16.12 98.11,99.38 98.11,86.68 | 68.9,73.98 68.9,63.18 IC5.12 68.9,61.28 68.9,48.58 | IC6.12 68.9,73.98 | 68.9,86.68 IC7.12 | 68.9,73.98 68.9,86.68 | IC8.12 68.9,99.38 68.9,86.68 | IC1.12 68.9,12.38 68.9,23.18 | IC2.12 68.9,23.18 | 68.9,23.18 68.9,35.88 IC3.12 68.9,37.78 68.9,48.58 | IC22.11 32.7,71.44 v32.7,57.78 | IC4.12 68.9,48.58
DATA-OUT5  (via drill 0.33)
  Top 0.152: IC22.13 47.62,80.01 49.21,78.42 v60.64,78.42 | IC13.15 89.85,60.64 63.82,60.64 IC5.15
  Bottom 0.152: IC9.15 90.49,12.38 90.49,23.18 | IC10.15 90.49,23.18 | 90.49,35.88 IC11.15 | 90.49,23.18 90.49,35.88 | 90.49,48.58 IC12.15 | 90.49,35.88 90.49,48.58 | 90.49,61.28 IC13.15 | 90.49,48.58 90.49,61.28 | 90.49,73.98 IC14.15 | 90.49,61.28 90.49,73.98 | 90.49,86.68 IC15.15 | 90.49,73.98 90.49,86.68 | IC16.15 90.49,99.38 90.49,86.68 | IC1.15 61.28,12.38 61.28,23.18 | IC2.15 61.28,23.18 | 61.28,35.88 IC3.15 | 61.28,23.18 61.28,35.88 | 61.28,48.58 IC4.15 | 61.28,35.88 61.28,48.58 | 61.28,48.58 61.28,61.28 IC5.15 61.28,63.18 61.28,77.79 | 61.28,77.79 62.23,76.83 IC6.15 | 61.28,77.79 v60.64,78.42 60.64,80.33 62.23,81.92 IC7.15 61.28,88.58 61.28,99.38 IC8.15
DATA-OUT6
  Top 0.152: IC22.15 30.16,86.04 58.1,86.04 IC7.16 | IC11.16 87.31,38.42 61.28,38.42 IC3.16
  Bottom 0.152: IC9.16 87.95,12.38 87.95,23.18 | IC10.16 87.95,23.18 | 87.95,35.88 IC11.16 | 87.95,23.18 87.95,35.88 | 87.95,48.58 IC12.16 | 87.95,35.88 87.95,48.58 | 87.95,61.28 IC13.16 | 87.95,48.58 87.95,61.28 | 87.95,73.98 IC14.16 | 87.95,61.28 87.95,73.98 | 87.95,86.68 IC15.16 | 87.95,73.98 87.95,86.68 | IC16.16 88.58,100.01 88.58,94.3 87.95,93.66 87.95,86.68 | IC8.16 58.74,99.38 58.74,88.58 IC7.16 58.74,86.68 58.74,73.98 | IC1.16 58.74,12.38 58.74,23.18 | IC2.16 58.74,23.18 | 58.74,35.88 IC3.16 | 58.74,23.18 58.74,35.88 | 58.74,48.58 IC4.16 | 58.74,35.88 58.74,48.58 | 58.74,61.28 IC5.16 | 58.74,48.58 58.74,61.28 | 58.74,73.98 IC6.16 | 58.74,61.28 58.74,73.98
DATA-OUT7  (via drill 0.33)
  Top 0.152: IC22.17 30.16,91.12 v50.8,91.12 | IC9.19 79.69,9.84 53.66,9.84 IC1.19
  Bottom 0.152: IC9.19 80.33,12.38 80.33,23.18 | IC10.19 80.33,23.18 | 80.33,35.88 IC11.19 | 80.33,23.18 80.33,35.88 | 80.33,48.58 IC12.19 | 80.33,35.88 80.33,48.58 | 80.33,61.28 IC13.19 | 80.33,48.58 80.33,61.28 | 80.33,73.98 IC14.19 | 80.33,61.28 80.33,73.98 | 80.33,86.68 IC15.19 | 80.33,73.98 80.33,86.68 | IC16.19 80.33,99.38 80.33,86.68 | IC1.19 51.12,12.38 51.12,23.18 | IC2.19 51.12,23.18 | 51.12,35.88 IC3.19 | 51.12,23.18 51.12,35.88 | 51.12,48.58 IC4.19 | 51.12,35.88 51.12,48.58 | 51.12,61.28 IC5.19 | 51.12,48.58 51.12,61.28 | 51.12,73.98 IC6.19 | 51.12,61.28 51.12,73.98 | 51.12,73.98 51.12,86.68 IC7.19 52.07,89.85 v50.8,91.12 50.8,99.06 IC8.19
DATAB-IN0  (via drill 0.33)
  Top 0.152: v55.24,107.31 55.88,106.68 73.98,106.68 74.3,107 80.96,107 81.6,106.36 v112.39,106.36 | IC37.3 141.92,42.86 142.56,42.86 142.88,43.18 142.88,44.13 115.25,44.13 IC29.3
  Bottom 0.152: IC34.3 141.92,4.76 141.92,15.56 | IC35.3 141.92,15.56 | 141.92,28.26 IC36.3 | 141.92,15.56 141.92,28.26 | 141.92,28.26 141.92,40.96 IC37.3 141.6,42.55 141.6,48.26 141.92,48.58 141.92,55.56 | 141.92,55.56 IC38.3 | 141.92,66.36 141.92,55.56 | IC39.3 141.92,66.36 | 141.92,79.06 IC40.3 | 141.92,66.36 141.92,79.06 | IC41.3 141.92,91.76 141.92,79.06 | IC26.3 113.98,4.76 113.98,15.56 | IC27.3 113.98,15.56 | 113.98,28.26 IC28.3 | 113.98,15.56 113.98,28.26 | 113.98,40.96 IC29.3 | 113.98,28.26 113.98,40.96 | 113.98,53.66 IC30.3 | 113.98,40.96 113.98,53.66 | 113.98,66.36 IC31.3 | 113.98,53.66 113.98,66.36 | 113.98,79.06 IC32.3 | 113.98,66.36 113.98,79.06 | 113.98,91.76 IC33.3 | 113.98,79.06 113.98,91.76 | IC46.18 55.24,111.12 v55.24,107.31 | v112.39,106.36 112.08,106.05 112.08,103.19 113.98,101.28 113.98,91.76
DATAB-IN1  (via drill 0.33)
  Top 0.152: v75.25,69.85 75.88,69.22 104.14,69.22 107.63,65.72 113.98,65.72 IC31.4 | IC35.4 141.92,18.1 117.16,18.1 IC27.4
  Bottom 0.152: IC34.4 144.46,4.76 144.46,15.56 | IC35.4 144.46,15.56 | 144.46,28.26 IC36.4 | 144.46,15.56 144.46,28.26 | 144.46,40.96 IC37.4 | 144.46,28.26 144.46,40.96 | 144.46,53.66 IC38.4 | 144.46,40.96 144.46,53.66 | 144.46,66.36 IC39.4 | 144.46,53.66 144.46,66.36 | 144.46,79.06 IC40.4 | 144.46,66.36 144.46,79.06 | IC41.4 144.46,91.76 144.46,79.06 | IC26.4 116.52,4.76 116.52,15.56 | IC27.4 116.52,15.56 | 116.52,28.26 IC28.4 | 116.52,15.56 116.52,28.26 | 116.52,40.96 IC29.4 | 116.52,28.26 116.52,40.96 | 116.52,53.66 IC30.4 | 116.52,40.96 116.52,53.66 | 116.52,66.36 IC31.4 | 116.52,53.66 116.52,66.36 | 116.52,79.06 IC32.4 | 116.52,66.36 116.52,79.06 | IC33.4 116.52,91.76 116.52,79.06 | IC46.16 61.28,113.35 75.25,113.35 v75.25,69.85
DATAB-IN2  (via drill 0.33)
  Top 0.152: v68.26,98.74 69.53,97.47 100.01,97.47 100.65,96.84 v123.51,96.84 | IC34.7 149.54,2.22 124.78,2.22 IC26.7
  Bottom 0.152: IC34.7 152.08,4.76 152.08,15.56 | IC35.7 152.08,15.56 | 152.08,28.26 IC36.7 | 152.08,15.56 152.08,28.26 | 152.08,40.96 IC37.7 | 152.08,28.26 152.08,40.96 | 152.08,53.66 IC38.7 | 152.08,40.96 152.08,53.66 | 152.08,66.36 IC39.7 | 152.08,53.66 152.08,66.36 | 152.08,79.06 IC40.7 | 152.08,66.36 152.08,79.06 | IC41.7 152.08,91.76 152.08,79.06 | IC26.7 124.14,4.76 124.14,15.56 | IC27.7 124.14,15.56 | 124.14,28.26 IC28.7 | 124.14,15.56 124.14,28.26 | 124.14,40.96 IC29.7 | 124.14,28.26 124.14,40.96 | 124.14,53.66 IC30.7 | 124.14,40.96 124.14,53.66 | 124.14,66.36 IC31.7 | 124.14,53.66 124.14,66.36 | 124.14,66.36 124.14,79.06 IC32.7 124.14,80.96 124.14,91.76 IC33.7 123.19,96.52 v123.51,96.84 | IC46.14 68.26,108.27 v68.26,98.74
DATAB-IN3  (via drill 0.33)
  Top 0.152: v71.12,96.52 122.87,96.52 125.73,93.66 IC33.8 | IC38.8 152.08,53.02 127.32,53.02 IC30.8
  Bottom 0.152: IC34.8 154.62,4.76 154.62,15.56 | IC35.8 154.62,15.56 | 154.62,28.26 IC36.8 | 154.62,15.56 154.62,28.26 | 154.62,40.96 IC37.8 | 154.62,28.26 154.62,40.96 | 154.62,53.66 IC38.8 | 154.62,40.96 154.62,53.66 | 154.62,66.36 IC39.8 | 154.62,53.66 154.62,66.36 | 154.62,79.06 IC40.8 | 154.62,66.36 154.62,79.06 | IC41.8 154.62,91.76 154.62,79.06 | IC26.8 126.68,4.76 126.68,15.56 | IC27.8 126.68,15.56 | 126.68,28.26 IC28.8 | 126.68,15.56 126.68,28.26 | 126.68,40.96 IC29.8 | 126.68,28.26 126.68,40.96 | 126.68,53.66 IC30.8 | 126.68,40.96 126.68,53.66 | 126.68,66.36 IC31.8 | 126.68,53.66 126.68,66.36 | 126.68,79.06 IC32.8 | 126.68,66.36 126.68,79.06 | IC33.8 126.68,91.76 126.68,79.06 | IC46.12 71.12,110.49 v71.12,96.52
DATAB-IN4  (via drill 0.33)
  Top 0.152: v71.44,89.53 71.44,86.04 99.38,86.04 100.65,87.31 100.65,89.22 102.87,89.22 107,85.09 109.86,85.09 112.08,87.31 112.08,89.22 124.14,89.22 IC32.13 | IC37.13 152.08,47.94 127.32,47.94 IC29.13
  Bottom 0.152: IC41.13 152.72,99.38 152.72,88.58 IC40.13 153.35,87.31 153.35,81.6 152.72,80.96 152.72,73.98 | IC34.13 152.72,12.38 152.72,23.18 | IC35.13 152.72,23.18 | 152.72,35.88 IC36.13 | 152.72,23.18 152.72,35.88 | 152.72,48.58 IC37.13 | 152.72,35.88 152.72,48.58 | 152.72,61.28 IC38.13 | 152.72,48.58 152.72,61.28 | 152.72,73.98 IC39.13 | 152.72,61.28 152.72,73.98 | IC26.13 124.78,12.38 124.78,23.18 | IC27.13 124.78,23.18 | 124.78,35.88 IC28.13 | 124.78,23.18 124.78,35.88 | 124.78,48.58 IC29.13 | 124.78,35.88 124.78,48.58 | 124.78,61.28 IC30.13 | 124.78,48.58 124.78,61.28 | 124.78,61.28 124.78,73.98 IC31.13 125.41,75.25 125.41,78.42 124.78,79.06 124.78,88.58 | 124.78,88.58 IC32.13 | 124.78,88.58 124.78,99.38 IC33.13 | IC46.9 70.8,103.19 70.8,97.16 70.48,96.84 70.48,93.98 71.44,93.03 v71.44,89.53
DATAB-IN5  (via drill 0.33)
  Top 0.152: v63.82,98.74 65.41,97.16 69.53,97.16 70.8,95.89 112.08,95.89 112.39,96.2 122.24,96.2 v122.56,95.89 | IC41.14 149.54,101.92 124.78,101.92 IC33.14
  Bottom 0.152: IC41.14 150.18,99.38 150.18,88.58 IC40.14 150.18,86.68 150.18,77.47 151.13,76.52 IC39.14 150.18,73.98 150.18,61.28 | IC34.14 150.18,12.38 150.18,23.18 | IC35.14 150.18,23.18 | 150.18,35.88 IC36.14 | 150.18,23.18 150.18,35.88 | 150.18,48.58 IC37.14 | 150.18,35.88 150.18,48.58 | 150.18,61.28 IC38.14 | 150.18,48.58 150.18,61.28 | IC26.14 122.24,12.38 122.24,23.18 | IC27.14 122.24,23.18 | 122.24,35.88 IC28.14 | 122.24,23.18 122.24,35.88 | 122.24,48.58 IC29.14 | 122.24,35.88 122.24,48.58 | 122.24,61.28 IC30.14 | 122.24,48.58 122.24,61.28 | 122.24,61.28 122.24,73.98 IC31.14 122.24,75.88 122.24,83.82 123.19,84.77 IC32.14 122.24,88.58 122.24,95.89 | 122.24,95.89 122.24,99.38 IC33.14 | IC46.7 63.82,103.19 v63.82,98.74 | 122.24,95.89 v122.56,95.89
DATAB-IN6  (via drill 0.33)
  Top 0.152: v61.59,84.45 61.91,84.77 112.08,84.77 114.94,87.63 IC32.17 | IC34.17 141.92,9.84 117.16,9.84 IC26.17
  Bottom 0.152: IC34.17 142.56,12.38 142.56,23.18 | IC35.17 142.56,23.18 | 142.56,23.18 142.56,35.88 IC36.17 142.56,37.78 142.56,42.86 143.51,43.81 IC37.17 142.56,50.48 142.56,61.28 | IC38.17 142.56,61.28 | 142.56,73.98 IC39.17 | 142.56,61.28 142.56,73.98 | 142.56,86.68 IC40.17 | 142.56,73.98 142.56,86.68 | IC41.17 142.56,99.38 142.56,86.68 | IC26.17 114.62,12.38 114.62,23.18 | IC27.17 114.62,23.18 | 114.62,35.88 IC28.17 | 114.62,23.18 114.62,35.88 | 114.62,48.58 IC29.17 | 114.62,35.88 114.62,48.58 | 114.62,61.28 IC30.17 | 114.62,48.58 114.62,61.28 | 114.62,73.98 IC31.17 | 114.62,61.28 114.62,73.98 | 114.62,86.68 IC32.17 | 114.62,73.98 114.62,86.68 | IC33.17 114.62,99.38 114.62,86.68 | IC46.5 60.96,102.87 60.96,85.09 v61.59,84.45
DATAB-IN7  (via drill 0.33)
  Top 0.152: v56.2,95.57 57.15,94.61 81.6,94.61 82.55,95.57 v112.71,95.57 | IC37.18 139.38,51.12 114.62,51.12 IC29.18
  Bottom 0.152: 140.02,86.68 140.02,75.88 IC39.18 140.65,74.61 140.65,68.9 140.02,68.26 140.02,61.28 | IC40.18 140.02,86.68 | IC41.18 140.02,99.38 140.02,86.68 | IC34.18 140.02,12.38 140.02,23.18 | IC35.18 140.02,23.18 | 140.02,35.88 IC36.18 | 140.02,23.18 140.02,35.88 | 140.02,48.58 IC37.18 | 140.02,35.88 140.02,48.58 | 140.02,61.28 IC38.18 | 140.02,48.58 140.02,61.28 | IC26.18 112.08,12.38 112.08,23.18 | IC27.18 112.08,23.18 | 112.08,35.88 IC28.18 | 112.08,23.18 112.08,35.88 | 112.08,48.58 IC29.18 | 112.08,35.88 112.08,48.58 | 112.08,61.28 IC30.18 | 112.08,48.58 112.08,61.28 | 112.08,73.98 IC31.18 | 112.08,61.28 112.08,73.98 | 112.08,86.68 IC32.18 | 112.08,73.98 112.08,86.68 | IC33.18 112.08,99.38 112.08,95.57 | 112.08,86.68 112.08,95.57 | IC46.3 56.2,102.55 v56.2,95.57 | 112.08,95.57 v112.71,95.57
DATAB-OUT0  (via drill 0.33)
  Top 0.152: v82.87,94.93 83.19,95.25 110.81,95.25 v111.12,94.93 | IC39.2 136.84,68.9 112.08,68.9 IC31.2
  Bottom 0.152: IC34.2 139.38,4.76 139.38,15.56 | IC35.2 139.38,15.56 | 139.38,28.26 IC36.2 | 139.38,15.56 139.38,28.26 | 139.38,40.96 IC37.2 | 139.38,28.26 139.38,40.96 | 139.38,53.66 IC38.2 | 139.38,40.96 139.38,53.66 | 139.38,66.36 IC39.2 | 139.38,53.66 139.38,66.36 | 139.38,79.06 IC40.2 | 139.38,66.36 139.38,79.06 | IC41.2 139.38,91.76 139.38,79.06 | IC26.2 111.44,4.76 111.44,15.56 | IC27.2 111.44,15.56 | 111.44,28.26 IC28.2 | 111.44,15.56 111.44,28.26 | 111.44,28.26 111.44,40.96 IC29.2 111.44,42.86 111.44,50.8 110.49,51.75 IC30.2 111.44,55.56 111.44,66.36 | IC31.2 111.44,66.36 | 111.44,79.06 IC32.2 | 111.44,66.36 111.44,79.06 | 111.44,79.06 111.44,91.76 IC33.2 110.49,94.3 v111.12,94.93 | IC47.2 82.87,102.55 v82.87,94.93
DATAB-OUT1  (via drill 0.33)
  Top 0.152: v87.95,94.61 88.27,94.93 110.17,94.93 110.81,94.3 116.52,94.3 IC33.5 | IC40.5 144.46,81.6 119.7,81.6 IC32.5
  Bottom 0.152: IC34.5 147,4.76 147,15.56 | IC35.5 147,15.56 | 147,28.26 IC36.5 | 147,15.56 147,28.26 | 147,40.96 IC37.5 | 147,28.26 147,40.96 | 147,53.66 IC38.5 | 147,40.96 147,53.66 | 147,66.36 IC39.5 | 147,53.66 147,66.36 | 147,79.06 IC40.5 | 147,66.36 147,79.06 | IC41.5 147,91.76 147,79.06 | IC33.5 119.06,91.76 119.06,80.96 IC32.5 118.43,79.69 118.43,76.52 119.06,75.88 119.06,66.36 | IC47.4 87.95,102.55 v87.95,94.61 | IC26.5 119.06,4.76 119.06,15.56 | IC27.5 119.06,15.56 | 119.06,28.26 IC28.5 | 119.06,15.56 119.06,28.26 | 119.06,40.96 IC29.5 | 119.06,28.26 119.06,40.96 | 119.06,53.66 IC30.5 | 119.06,40.96 119.06,53.66 | 119.06,66.36 IC31.5 | 119.06,53.66 119.06,66.36
DATAB-OUT2  (via drill 0.33)
  Top 0.152: IC47.6 93.34,102.23 104.14,102.23 108.27,98.11 v120.33,98.11 | IC36.6 147,30.8 122.24,30.8 IC28.6
  Bottom 0.152: IC34.6 149.54,4.76 149.54,15.56 | IC35.6 149.54,15.56 | 149.54,28.26 IC36.6 | 149.54,15.56 149.54,28.26 | 149.54,40.96 IC37.6 | 149.54,28.26 149.54,40.96 | 149.54,53.66 IC38.6 | 149.54,40.96 149.54,53.66 | 149.54,66.36 IC39.6 | 149.54,53.66 149.54,66.36 | 149.54,79.06 IC40.6 | 149.54,66.36 149.54,79.06 | IC41.6 149.54,91.76 149.54,79.06 | IC26.6 121.6,4.76 121.6,15.56 | IC27.6 121.6,15.56 | 121.6,28.26 IC28.6 | 121.6,15.56 121.6,28.26 | 121.6,40.96 IC29.6 | 121.6,28.26 121.6,40.96 | 121.6,53.66 IC30.6 | 121.6,40.96 121.6,53.66 | 121.6,66.36 IC31.6 | 121.6,53.66 121.6,66.36 | 121.6,79.06 IC32.6 | 121.6,66.36 121.6,79.06 | 121.6,79.06 121.6,91.76 IC33.6 120.65,97.79 v120.33,98.11
DATAB-OUT3  (via drill 0.33)
  Top 0.152: v97.47,94.3 97.47,91.12 126.68,91.12 IC33.9 | IC40.9 154.62,78.42 129.86,78.42 IC32.9
  Bottom 0.152: IC34.9 157.16,4.76 157.16,15.56 | IC35.9 157.16,15.56 | 157.16,28.26 IC36.9 | 157.16,15.56 157.16,28.26 | 157.16,40.96 IC37.9 | 157.16,28.26 157.16,40.96 | 157.16,53.66 IC38.9 | 157.16,40.96 157.16,53.66 | 157.16,66.36 IC39.9 | 157.16,53.66 157.16,66.36 | 157.16,79.06 IC40.9 | 157.16,66.36 157.16,79.06 | IC41.9 157.16,91.76 157.16,79.06 | IC26.9 129.22,4.76 129.22,15.56 | IC27.9 129.22,15.56 | 129.22,28.26 IC28.9 | 129.22,15.56 129.22,28.26 | 129.22,40.96 IC29.9 | 129.22,28.26 129.22,40.96 | 129.22,53.66 IC30.9 | 129.22,40.96 129.22,53.66 | 129.22,66.36 IC31.9 | 129.22,53.66 129.22,66.36 | 129.22,79.06 IC32.9 | 129.22,66.36 129.22,79.06 | IC33.9 129.22,91.76 129.22,79.06 | IC47.8 97.47,103.19 v97.47,94.3
DATAB-OUT4  (via drill 0.33)
  Top 0.152: v106.05,74.93 107.63,73.34 126.68,73.34 IC31.12 | IC34.12 154.62,13.02 129.86,13.02 IC26.12
  Bottom 0.152: IC34.12 155.26,12.38 155.26,23.18 | IC35.12 155.26,23.18 | 155.26,35.88 IC36.12 | 155.26,23.18 155.26,35.88 | 155.26,35.88 155.26,48.58 IC37.12 155.26,50.48 155.26,58.74 156.21,59.69 IC38.12 155.26,63.18 155.26,73.98 | IC39.12 155.26,73.98 | 155.26,86.68 IC40.12 | 155.26,73.98 155.26,86.68 | IC41.12 155.26,99.38 155.26,86.68 | IC26.12 127.32,12.38 127.32,23.18 | IC27.12 127.32,23.18 | 127.32,35.88 IC28.12 | 127.32,23.18 127.32,35.88 | 127.32,48.58 IC29.12 | 127.32,35.88 127.32,48.58 | 127.32,61.28 IC30.12 | 127.32,48.58 127.32,61.28 | 127.32,73.98 IC31.12 | 127.32,61.28 127.32,73.98 | 127.32,86.68 IC32.12 | 127.32,73.98 127.32,86.68 | IC33.12 127.32,99.38 127.32,86.68 | IC47.11 106.05,107.31 v106.05,74.93
DATAB-OUT5  (via drill 0.33)
  Top 0.152: IC47.13 98.74,109.54 v114.62,109.54 | IC36.15 147,35.24 122.24,35.24 IC28.15
  Bottom 0.152: IC34.15 147.64,12.38 147.64,23.18 | IC35.15 147.64,23.18 | 147.64,35.88 IC36.15 | 147.64,23.18 147.64,35.88 | 147.64,48.58 IC37.15 | 147.64,35.88 147.64,48.58 | 147.64,61.28 IC38.15 | 147.64,48.58 147.64,61.28 | 147.64,73.98 IC39.15 | 147.64,61.28 147.64,73.98 | 147.64,86.68 IC40.15 | 147.64,73.98 147.64,86.68 | IC41.15 147.64,99.38 147.64,86.68 | IC26.15 119.7,12.38 119.7,23.18 | IC27.15 119.7,23.18 | 119.7,35.88 IC28.15 | 119.7,23.18 119.7,35.88 | 119.7,48.58 IC29.15 | 119.7,35.88 119.7,48.58 | 119.7,61.28 IC30.15 | 119.7,48.58 119.7,61.28 | 119.7,73.98 IC31.15 | 119.7,61.28 119.7,73.98 | 119.7,86.68 IC32.15 | 119.7,73.98 119.7,86.68 | 119.7,99.38 IC33.15 | 119.7,86.68 119.7,99.38 | v114.62,109.54 119.7,104.46 119.7,99.38
DATAB-OUT6  (via drill 0.33)
  Top 0.152: IC47.15 94.3,108.9 v113.67,108.9 | IC40.16 144.46,86.04 119.7,86.04 IC32.16
  Bottom 0.152: IC34.16 145.1,12.38 145.1,23.18 | IC35.16 145.1,23.18 | 145.1,35.88 IC36.16 | 145.1,23.18 145.1,35.88 | 145.1,35.88 145.1,48.58 IC37.16 145.1,50.48 145.1,58.1 146.05,59.05 IC38.16 145.1,63.18 145.1,73.98 | IC39.16 145.1,73.98 | 145.1,86.68 IC40.16 | 145.1,73.98 145.1,86.68 | IC41.16 145.1,99.38 145.1,86.68 | IC26.16 117.16,12.38 117.16,23.18 | IC27.16 117.16,23.18 | 117.16,35.88 IC28.16 | 117.16,23.18 117.16,35.88 | 117.16,48.58 IC29.16 | 117.16,35.88 117.16,48.58 | 117.16,61.28 IC30.16 | 117.16,48.58 117.16,61.28 | 117.16,73.98 IC31.16 | 117.16,61.28 117.16,73.98 | 117.16,86.68 IC32.16 | 117.16,73.98 117.16,86.68 | 117.16,99.38 IC33.16 | 117.16,86.68 117.16,99.38 | v113.67,108.9 117.16,105.41 117.16,99.38
DATAB-OUT7  (via drill 0.33)
  Top 0.152: v87.63,105.41 87.95,105.73 96.84,105.73 98.11,104.46 98.11,102.55 108.27,102.55 IC33.19 | IC38.19 136.84,60.64 112.08,60.64 IC30.19
  Bottom 0.152: IC34.19 137.48,12.38 137.48,23.18 | IC35.19 137.48,23.18 | 137.48,35.88 IC36.19 | 137.48,23.18 137.48,35.88 | 137.48,48.58 IC37.19 | 137.48,35.88 137.48,48.58 | 137.48,61.28 IC38.19 | 137.48,48.58 137.48,61.28 | 137.48,73.98 IC39.19 | 137.48,61.28 137.48,73.98 | 137.48,73.98 137.48,80.96 137.79,81.28 137.79,87 IC40.19 138.43,89.85 137.48,90.81 137.48,93.66 137.79,93.98 137.79,99.69 IC41.19 | IC26.19 109.54,12.38 109.54,23.18 | IC27.19 109.54,23.18 | 109.54,35.88 IC28.19 | 109.54,23.18 109.54,35.88 | 109.54,48.58 IC29.19 | 109.54,35.88 109.54,48.58 | 109.54,61.28 IC30.19 | 109.54,48.58 109.54,61.28 | 109.54,73.98 IC31.19 | 109.54,61.28 109.54,73.98 | 109.54,86.68 IC32.19 | 109.54,73.98 109.54,86.68 | IC33.19 109.54,99.38 109.54,86.68 | IC47.17 87.63,110.49 v87.63,105.41
GND  (via drill 0.33)
  Top 0.152: 11.43,104.46 IC21.19 | 11.43,104.46 10.48,104.46 IC21.1 | X1.A32 X1.B32 X1.C32 | IC46.1 33.02,104.14 IC21.10 30.16,104.46 11.43,104.46 | X1.A1 X1.B1 X1.C1 | IC19.8 35.56,59.69 IC23.10 IC23.9 24.13,52.07 | IC23.5 IC23.4 | IC23.7 24.13,52.07 | 24.13,52.07 IC24.13 | IC24.7 22.54,33.34 34.61,33.34 IC18.8 | IC43.8 IC41.10 | IC42.8 154.94,102.87 v155.57,102.87 | IC44.8 162.56,67.31 IC39.10 | IC45.8 126.68,103.19 v127.64,103.19 | 73.98,5.4 IC1.10 | 100.01,5.4 73.98,5.4 | IC9.10 100.01,5.4 | 129.22,5.4 IC26.10 | 100.01,5.4 129.22,5.4 | IC34.10 157.16,5.4 129.22,5.4 | IC17.8 36.51,5.4 73.98,5.4
  Bottom 0.152: IC21.1 7.62,101.6 X1.B32 | IC46.19 49.53,109.22 IC46.1 | IC25.8 20,13.02 20,27.62 | 20,27.62 20,32.7 IC24.7 | 20,27.62 X1.C1 | IC20.8 37.78,84.14 37.78,79.69 38.42,79.06 38.42,72.07 38.73,71.75 38.73,62.87 IC19.8 | IC17.8 33.97,7.94 33.97,32.7 IC18.8 30.8,39.05 30.8,40.32 IC24.11 27.62,43.5 27.62,45.4 IC24.13 | IC23.7 20,56.2 20,58.1 | IC23.5 20,58.1 | IC22.10 20,73.34 20,65.72 | 20,58.1 20,65.72 | IC21.19 13.02,108.9 13.02,72.71 20,65.72 | 159.7,3.81 172.72,3.81 PWR.K | 159.7,3.81 IC34.10 | 159.7,15.56 IC35.10 | 159.7,3.81 159.7,15.56 | 159.7,28.26 IC36.10 | 159.7,15.56 159.7,28.26 | 159.7,28.26 159.7,40.96 IC37.10 157.8,42.86 157.8,55.56 | v155.57,102.87 157.8,100.65 157.8,93.66 IC41.10 157.8,91.76 157.8,79.06 | 157.8,55.56 IC38.10 | 157.8,66.36 157.8,55.56 | IC39.10 157.8,66.36 | 157.8,79.06 IC40.10 | 157.8,66.36 157.8,79.06 | IC26.10 129.86,4.76 129.86,15.56 | IC27.10 129.86,15.56 | 129.86,28.26 IC28.10 | 129.86,15.56 129.86,28.26 | 129.86,40.96 IC29.10 | 129.86,28.26 129.86,40.96 | 129.86,53.66 IC30.10 | 129.86,40.96 129.86,53.66 | 129.86,66.36 IC31.10 | 129.86,53.66 129.86,66.36 | 129.86,79.06 IC32.10 | 129.86,66.36 129.86,79.06 | 129.86,91.76 IC33.10 | 129.86,79.06 129.86,91.76 | v127.64,103.19 129.86,100.97 129.86,91.76 | 71.44,79.06 71.44,68.26 IC6.10 71.12,66.04 71.12,55.88 IC5.10 71.44,53.66 71.44,40.96 | IC7.10 71.44,79.06 | 71.44,79.06 71.44,88.58 72.07,89.22 72.07,92.39 IC8.10 72.39,96.2 71.44,97.16 71.44,103.19 IC46.10 | IC1.10 71.44,4.76 71.44,15.56 | IC2.10 71.44,15.56 | 71.44,28.26 IC3.10 | 71.44,15.56 71.44,28.26 | 71.44,40.96 IC4.10 | 71.44,28.26 71.44,40.96 | IC9.10 100.65,4.76 100.65,15.56 | IC10.10 100.65,15.56
  Bottom 0.152: 100.65,28.26 IC11.10 | 100.65,15.56 100.65,28.26 | 100.65,40.96 IC12.10 | 100.65,28.26 100.65,40.96 | 100.65,53.66 IC13.10 | 100.65,40.96 100.65,53.66 | 100.65,66.36 IC14.10 | 100.65,53.66 100.65,66.36 | 100.65,79.06 IC15.10 | 100.65,66.36 100.65,79.06 | 100.65,91.76 IC16.10 | 100.65,79.06 100.65,91.76 | IC47.10 100.65,103.19 100.65,91.76
MEM0-LD  (via drill 0.33)
  Top 0.152: IC1.11 70.17,13.65 v46.35,13.65
  Bottom 0.152: v46.35,13.65 45.72,14.29 45.72,59.69 46.67,60.64 46.67,73.98 IC19.15
MEM0-RD
  Bottom 0.152: IC1.1 41.59,3.81 41.59,11.75 42.86,13.02 44.77,13.02 44.77,20 IC17.15
MEM0B-LD
  Bottom 0.152: IC26.11 137.48,4.76 137.48,2.86 138.11,2.22 174.94,2.22 174.94,82.87 IC44.15
MEM0B-RD  (via drill 0.33)
  Top 0.152: v129.22,97.47 129.86,98.11 v135.57,98.11
  Bottom 0.152: IC26.1 109.86,1.91 129.54,1.91 129.54,97.16 v129.22,97.47 | v135.57,98.11 137.48,100.01 137.48,107.63 138.43,108.58 IC42.15
MEM1-LD  (via drill 0.33)
  Top 0.152: v76.52,72.39 75.88,73.03 45.09,73.03 IC19.14
  Bottom 0.152: IC2.11 75.25,26.99 75.25,68.26 76.52,69.53 v76.52,72.39
MEM1-RD
  Top 0.152: IC17.14 43.5,18.73 47.31,18.73 IC2.1
MEM1B-LD  (via drill 0.33)
  Top 0.152: IC27.11 133.99,27.3 159.7,27.3 v174.31,41.91
  Bottom 0.152: v174.31,41.91 174.62,42.23 174.62,80.64 IC44.14
MEM1B-RD
  Bottom 0.152: IC27.1 109.22,15.24 109.22,3.17 110.17,2.22 127,2.22 127,106.68 133.67,113.35 140.97,113.35 IC42.14
MEM2-LD  (via drill 0.33)
  Top 0.152: v75.88,71.75 75.56,71.44 44.77,71.44 IC19.13
  Bottom 0.152: IC3.11 74.93,39.37 74.93,68.58 75.88,69.53 v75.88,71.75
MEM2-RD
  Top 0.152: IC17.13 41.59,18.1 41.59,20.64 47.94,20.64 50.48,23.18 50.48,26.99 45.4,26.99 44.13,28.26 44.13,29.21 IC3.1
MEM2B-LD  (via drill 0.33)
  Top 0.152: IC28.11 133.99,40.01 159.7,40.01 v173.99,54.29
  Bottom 0.152: v173.99,54.29 174.31,54.61 174.31,78.42 IC44.13
MEM2B-RD  (via drill 0.33)
  Top 0.152: IC28.1 114.62,35.88 114.62,40.32 132.4,40.32 135.57,43.5 v142.24,43.5
  Bottom 0.152: v142.24,43.5 142.24,110.49 IC42.13
MEM3-LD  (via drill 0.33)
  Top 0.152: v42.86,58.1 44.77,56.2 49.85,56.2 51.12,54.93 51.12,51.75 70.17,51.75 IC4.11
  Bottom 0.152: IC19.12 42.86,66.99 v42.86,58.1
MEM3-RD  (via drill 0.33)
  Top 0.152: v40.96,39.37 42.55,40.96 48.58,40.96 IC4.1
  Bottom 0.152: IC17.12 40.96,16.19 v40.96,39.37
MEM3B-LD  (via drill 0.33)
  Top 0.152: v133.35,77.15 163.51,77.15 164.15,76.52 171.77,76.52 IC44.12
  Bottom 0.152: IC29.11 133.35,52.07 v133.35,77.15
MEM3B-RD  (via drill 0.33)
  Top 0.152: v107.31,85.72 107.31,86.36 107,86.68 107,90.81 130.81,90.81 135.89,95.89 v143.19,95.89
  Bottom 0.152: IC29.1 107,42.86 107,85.41 v107.31,85.72 | v143.19,95.89 144.46,97.16 144.46,110.17 IC42.12
MEM4-LD
  Top 0.152: IC19.11 45.09,65.41 75.25,65.41 76.52,64.14 76.52,62.23 IC5.11
MEM4-RD  (via drill 0.33)
  Top 0.152: IC17.11 47.31,15.56 v47.62,15.56
  Bottom 0.152: v47.62,15.56 48.26,16.19 48.26,46.99 48.58,47.31 48.58,53.66 IC5.1
MEM4B-LD
  Top 0.152: IC30.11 134.3,65.72 170.5,65.72 174.31,69.53 174.31,74.93 IC44.11
MEM4B-RD  (via drill 0.33)
  Top 0.152: IC30.1 113.03,59.69 v155.26,59.69
  Bottom 0.152: v155.26,59.69 154.94,60.01 154.94,112.39 153.99,113.35 148.59,113.35 IC42.11
MEM5-LD  (via drill 0.33)
  Top 0.152: IC19.10 45.72,64.77 v71.75,64.77
  Bottom 0.152: v71.75,64.77 73.34,66.36 73.34,73.98 IC6.11
MEM5-RD  (via drill 0.33)
  Top 0.152: v46.04,66.99 46.35,67.31 IC6.1
  Bottom 0.152: IC17.10 45.4,11.11 45.4,60.01 46.04,60.64 v46.04,66.99
MEM5B-LD
  Top 0.152: IC31.11 133.35,74.93 136.84,71.44 171.77,71.44 IC44.10
MEM5B-RD  (via drill 0.33)
  Top 0.152: IC31.1 110.81,70.17 v140.02,70.17
  Bottom 0.152: v140.02,70.17 139.7,70.48 139.7,100.97 141.92,103.19 141.92,112.08 143.19,113.35 147.64,113.35 147.64,110.81 148.27,110.17 151.13,110.17 IC42.10
MEM6-LD  (via drill 0.33)
  Top 0.152: IC19.9 45.72,59.69 v71.75,59.69
  Bottom 0.152: v71.75,59.69 74.3,62.23 74.3,69.85 73.98,70.17 73.98,86.04 IC7.11
MEM6-RD
  Bottom 0.152: IC17.9 46.99,10.16 46.99,46.35 48.26,47.62 48.26,57.47 48.58,57.78 48.58,79.06 IC7.1
MEM6B-LD  (via drill 0.33)
  Top 0.152: v132.72,74.3 136.21,70.8 171.77,70.8 IC44.9
  Bottom 0.152: IC32.11 132.72,85.72 v132.72,74.3
MEM6B-RD  (via drill 0.33)
  Top 0.152: IC32.1 113.67,85.72 v152.72,85.72
  Bottom 0.152: v152.72,85.72 152.4,86.04 152.4,110.49 IC42.9
MEM7-LD  (via drill 0.33)
  Top 0.152: IC19.7 43.18,69.85 73.98,69.85 v74.61,70.48
  Bottom 0.152: v74.61,70.48 74.3,70.8 74.3,98.42 IC8.11
MEM7-RD  (via drill 0.33)
  Top 0.152: IC17.7 36.51,7.94 v47.94,7.94
  Bottom 0.152: v47.94,7.94 50.8,10.79 50.8,90.17 49.53,91.44 IC8.1
MEM7B-LD  (via drill 0.33)
  Top 0.152: IC33.11 132.4,98.74 156.53,98.74 157.8,100.01 157.8,101.92 161.61,101.92 164.15,99.38 167,99.38 167.96,100.33 167.96,101.6 v167.64,101.6
  Bottom 0.152: v167.64,101.6 167.96,101.28 167.96,75.25 IC44.7
MEM7B-RD  (via drill 0.33)
  Top 0.152: v108.9,108.27 136.84,108.27 137.16,107.95 v147.32,107.95
  Bottom 0.152: IC33.1 109.22,93.98 109.22,107.95 v108.9,108.27 | IC42.7 v147.32,107.95
MEM8-LD
  Bottom 0.152: IC9.11 102.55,10.48 102.55,2.86 101.92,2.22 40.32,2.22 40.32,100.65 43.5,103.82 46.04,103.82 46.04,101.92 IC20.15
MEM8-RD  (via drill 0.33)
  Top 0.152: v76.83,47.62 45.09,47.62 IC18.15
  Bottom 0.152: IC9.1 76.83,5.71 v76.83,47.62
MEM8B-LD  (via drill 0.33)
  Top 0.152: IC34.11 156.84,9.53 v115.57,9.53
  Bottom 0.152: v115.57,9.53 114.3,10.79 114.3,105.73 114.62,106.05 114.62,107 110.49,111.12 IC45.15
MEM8B-RD